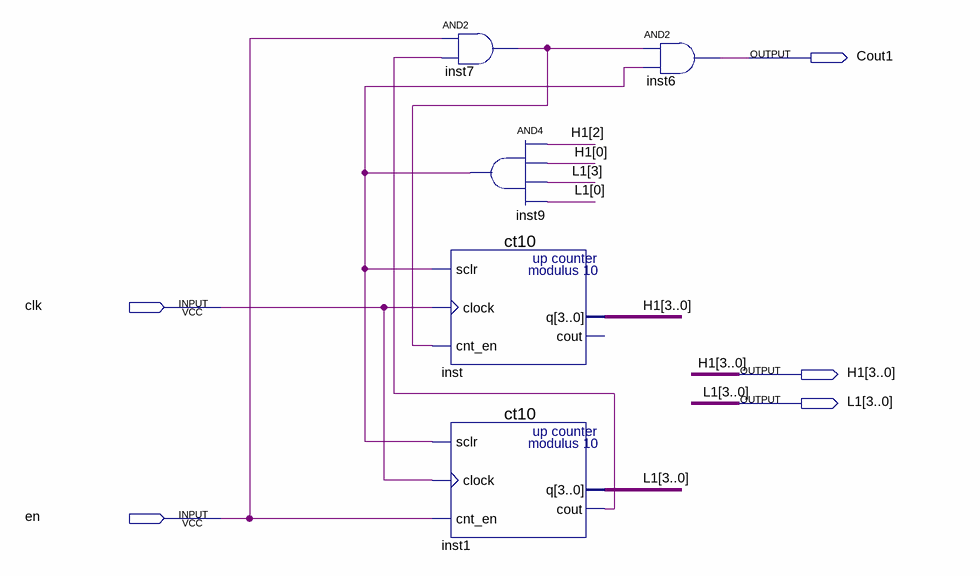
[diagram p0: schematic sheet]
// Quartus schematic block60_2.bdf as structural Verilog: 5 symbols, 5 pins
module block60_2 (
  input  clk,
  input  en,
  output Cout1,
  output [3:0] H1,
  output [3:0] L1
);

  wire inst1_cout, inst7_out, inst9_out;

  ct10 inst (.sclr(inst9_out), .clock(clk), .cnt_en(inst7_out), .q(H1));  // open: cout
  ct10 inst1 (.sclr(inst9_out), .clock(clk), .cnt_en(en), .q(L1), .cout(inst1_cout));
  and inst7 (inst7_out, en, inst1_cout);
  and inst9 (inst9_out, H1[2], H1[0], L1[3], L1[0]);
  and inst6 (Cout1, inst7_out, inst9_out);
endmodule
